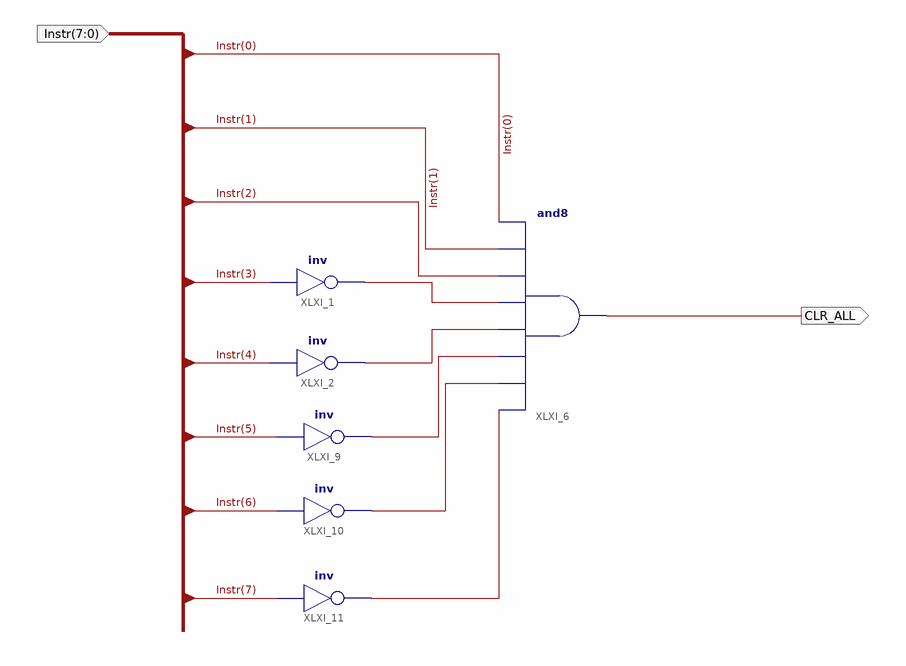
[diagram p0: schematic sheet 1]
// Xilinx ISE schematic instrCLR.sch (spartan3e) as structural Verilog: 6 symbols, 2 ports
module instrCLR (
  input  [7:0] Instr,
  output CLR_ALL
);

  wire XLXN_2, XLXN_3, XLXN_4, XLXN_5, XLXN_10;

  not XLXI_1 (XLXN_2, Instr[3]);
  not XLXI_2 (XLXN_3, Instr[4]);
  not XLXI_9 (XLXN_4, Instr[5]);
  not XLXI_10 (XLXN_5, Instr[6]);
  not XLXI_11 (XLXN_10, Instr[7]);
  and XLXI_6 (CLR_ALL, XLXN_10, XLXN_5, XLXN_4, XLXN_3, XLXN_2, Instr[2], Instr[1], Instr[0]);
endmodule
